# EAGLE design VFDClock (EAGLE 9.2.2)

## Sheet 1 of 3: Power and Logic
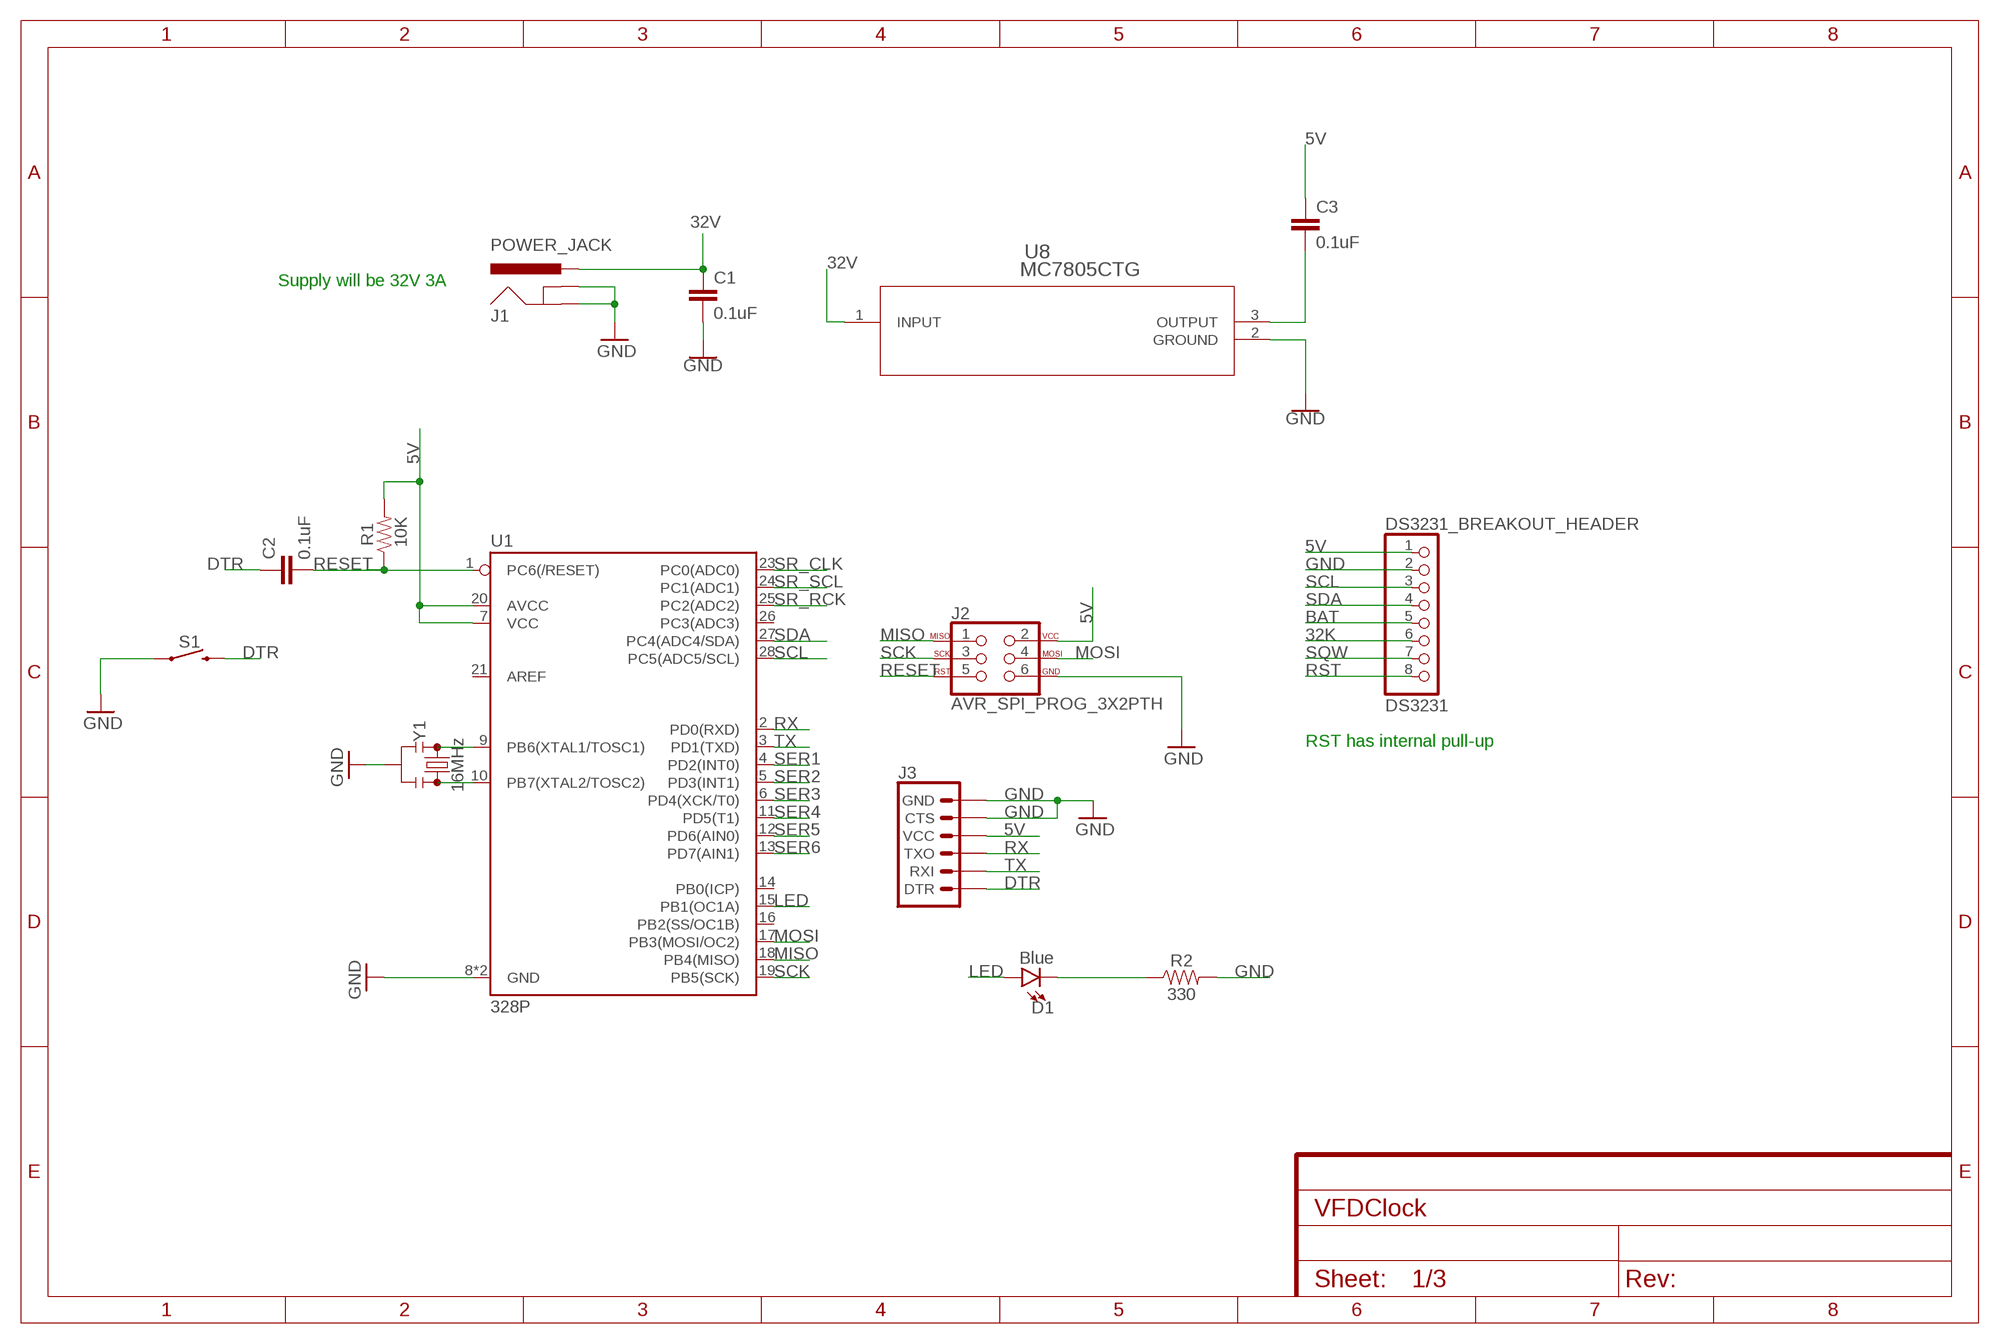
[diagram p0: schematic, sheet 1]

### Parts
C1  0.1uF  0.1UF-KIT-EZ-50V-20%  [CAP-PTH-SMALL-KIT]
C2  0.1uF  0.1UF-KIT-EZ-50V-20%  [CAP-PTH-SMALL-KIT]
C3  0.1uF  .1UF-CER  [0402-CAP]
D1  Blue  LED5MM  [LED_5MM]
DS3231_BREAKOUT_HEADER  DS3231  HEADER-1X870MIL  [1X08_ROUND_70]
J1  POWER_JACK  [POWER_JACK_PTH]
J2  AVR_SPI_PROG_3X2PTH  [2X3]
J3  6_PIN_SERIAL_TARGETLONGPADS  [1X06_LONGPADS]
R1  10K  RESISTORAXIAL-0.3  [AXIAL-0.3]
R2  330  330OHM-HORIZ-1/10W-5%  [AXIAL-0.3]
S1  MOMENTARY-SWITCH-SPST-PTH-6.0MM  [TACTILE_SWITCH_PTH_6.0MM]
U1  328P  ATMEGA328P_PDIP  [DIP28]
U8  MC7805CTG  [TO-220AB]
Y1  16MHz  RESONATORPTH-7.6X3.8  [RESONATOR-PTH-7.6X3.8]

### Nets
5V: C3.1 DS3231_BREAKOUT_HEADER.1 J2.2 J3.4(VCC) R1.P$2 U1.7(VCC) U1.20(AVCC) ; also sheet 3
5V_BEFORECAP: C3.2 U8.3(OUTPUT)
32K: DS3231_BREAKOUT_HEADER.6
32V: C1.1 J1.PWR U8.1(INPUT) ; also sheet 2,3
BAT: DS3231_BREAKOUT_HEADER.5
DTR: C2.1 J3.1(DTR) S1.3
GND: C1.2 DS3231_BREAKOUT_HEADER.2 J1.GND J1.GNDBREAK J2.6 J3.5(CTS) J3.6(GND) R2.P$2 S1.1 U1.8(GND) U1.22(GND) U8.2(GROUND) Y1.2 ; also sheet 2,3
LED: D1.A U1.15(PB1(OC1A))
MISO: J2.1 U1.18(PB4(MISO))
MOSI: J2.4 U1.17(PB3(MOSI/OC2))
N$9: U1.9(PB6(XTAL1/TOSC1)) Y1.1
N$10: U1.10(PB7(XTAL2/TOSC2)) Y1.3
N$51: D1.K(C) R2.P$1
RESET: C2.2 J2.5 R1.P$1 U1.1(PC6(/RESET))
RST: DS3231_BREAKOUT_HEADER.8
RX: J3.3(TXO) U1.2(PD0(RXD))
SCK: J2.3 U1.19(PB5(SCK))
SCL: DS3231_BREAKOUT_HEADER.3 U1.28(PC5(ADC5/SCL))
SDA: DS3231_BREAKOUT_HEADER.4 U1.27(PC4(ADC4/SDA))
SER1: U1.4(PD2(INT0)) ; also sheet 3
SER2: U1.5(PD3(INT1)) ; also sheet 3
SER3: U1.6(PD4(XCK/T0)) ; also sheet 3
SER4: U1.11(PD5(T1)) ; also sheet 3
SER5: U1.12(PD6(AIN0)) ; also sheet 3
SER6: U1.13(PD7(AIN1)) ; also sheet 3
SQW: DS3231_BREAKOUT_HEADER.7
SR_CLK: U1.23(PC0(ADC0)) ; also sheet 3
SR_RCK: U1.25(PC2(ADC2)) ; also sheet 3
SR_SCL: U1.24(PC1(ADC1)) ; also sheet 3
TX: J3.2(RXI) U1.3(PD1(TXD))
Unconnected: U1.14(PB0(ICP)) U1.16(PB2(SS/OC1B)) U1.21(AREF) U1.26(PC3(ADC3))

### Notes on the sheet
- Supply will be 32V 3A
- RST has internal pull-up

## Sheet 2 of 3: VFDs
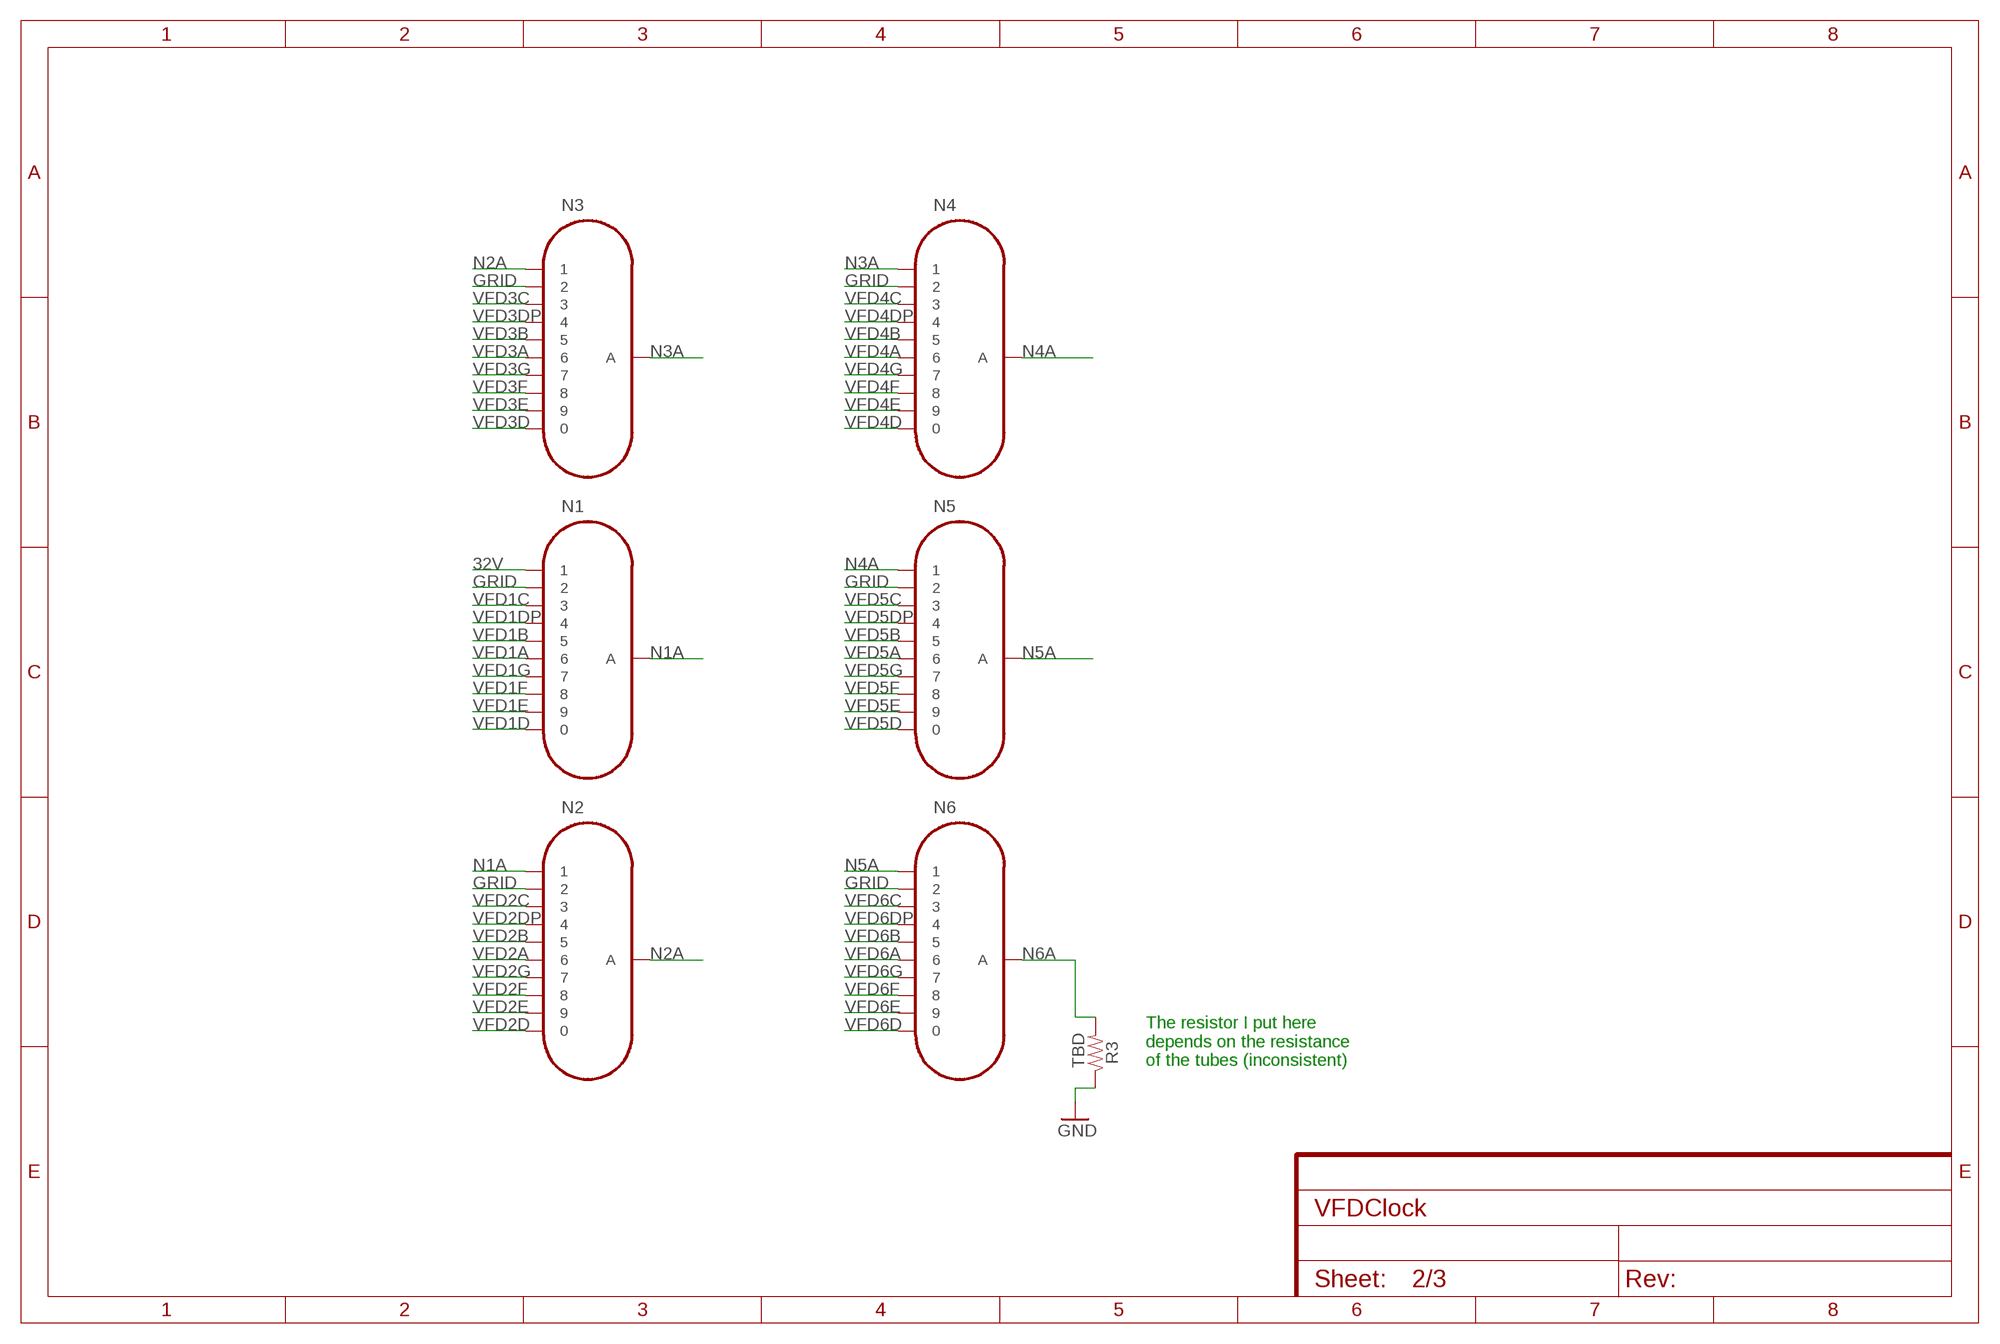
[diagram p1: schematic, sheet 2]

### Parts
N1  IN-8  [IN-8]
N2  IN-8  [IN-8]
N3  IN-8  [IN-8]
N4  IN-8  [IN-8]
N5  IN-8  [IN-8]
N6  IN-8  [IN-8]
R3  TBD  RESISTORAXIAL-0.3  [AXIAL-0.3]

### Nets
32V: N1.1 ; also sheet 1,3
GND: R3.P$1 ; also sheet 1,3
GRID: N1.2 N2.2 N3.2 N4.2 N5.2 N6.2
N1A: N1.A N2.1
N2A: N2.A N3.1
N3A: N3.A N4.1
N4A: N4.A N5.1
N5A: N5.A N6.1
N6A: N6.A R3.P$2
VFD1A: N1.6 ; also sheet 3
VFD1B: N1.5 ; also sheet 3
VFD1C: N1.3 ; also sheet 3
VFD1D: N1.0 ; also sheet 3
VFD1DP: N1.4 ; also sheet 3
VFD1E: N1.9 ; also sheet 3
VFD1F: N1.8 ; also sheet 3
VFD1G: N1.7 ; also sheet 3
VFD2A: N2.6 ; also sheet 3
VFD2B: N2.5 ; also sheet 3
VFD2C: N2.3 ; also sheet 3
VFD2D: N2.0 ; also sheet 3
VFD2DP: N2.4 ; also sheet 3
VFD2E: N2.9 ; also sheet 3
VFD2F: N2.8 ; also sheet 3
VFD2G: N2.7 ; also sheet 3
VFD3A: N3.6 ; also sheet 3
VFD3B: N3.5 ; also sheet 3
VFD3C: N3.3 ; also sheet 3
VFD3D: N3.0 ; also sheet 3
VFD3DP: N3.4 ; also sheet 3
VFD3E: N3.9 ; also sheet 3
VFD3F: N3.8 ; also sheet 3
VFD3G: N3.7 ; also sheet 3
VFD4A: N4.6 ; also sheet 3
VFD4B: N4.5 ; also sheet 3
VFD4C: N4.3 ; also sheet 3
VFD4D: N4.0 ; also sheet 3
VFD4DP: N4.4 ; also sheet 3
VFD4E: N4.9 ; also sheet 3
VFD4F: N4.8 ; also sheet 3
VFD4G: N4.7 ; also sheet 3
VFD5A: N5.6 ; also sheet 3
VFD5B: N5.5 ; also sheet 3
VFD5C: N5.3 ; also sheet 3
VFD5D: N5.0 ; also sheet 3
VFD5DP: N5.4 ; also sheet 3
VFD5E: N5.9 ; also sheet 3
VFD5F: N5.8 ; also sheet 3
VFD5G: N5.7 ; also sheet 3
VFD6A: N6.6 ; also sheet 3
VFD6B: N6.5 ; also sheet 3
VFD6C: N6.3 ; also sheet 3
VFD6D: N6.0 ; also sheet 3
VFD6DP: N6.4 ; also sheet 3
VFD6E: N6.9 ; also sheet 3
VFD6F: N6.8 ; also sheet 3
VFD6G: N6.7 ; also sheet 3

### Notes on the sheet
- The resistor I put here
  depends on the resistance
  of the tubes (inconsistent)

## Sheet 3 of 3: High Side Switches
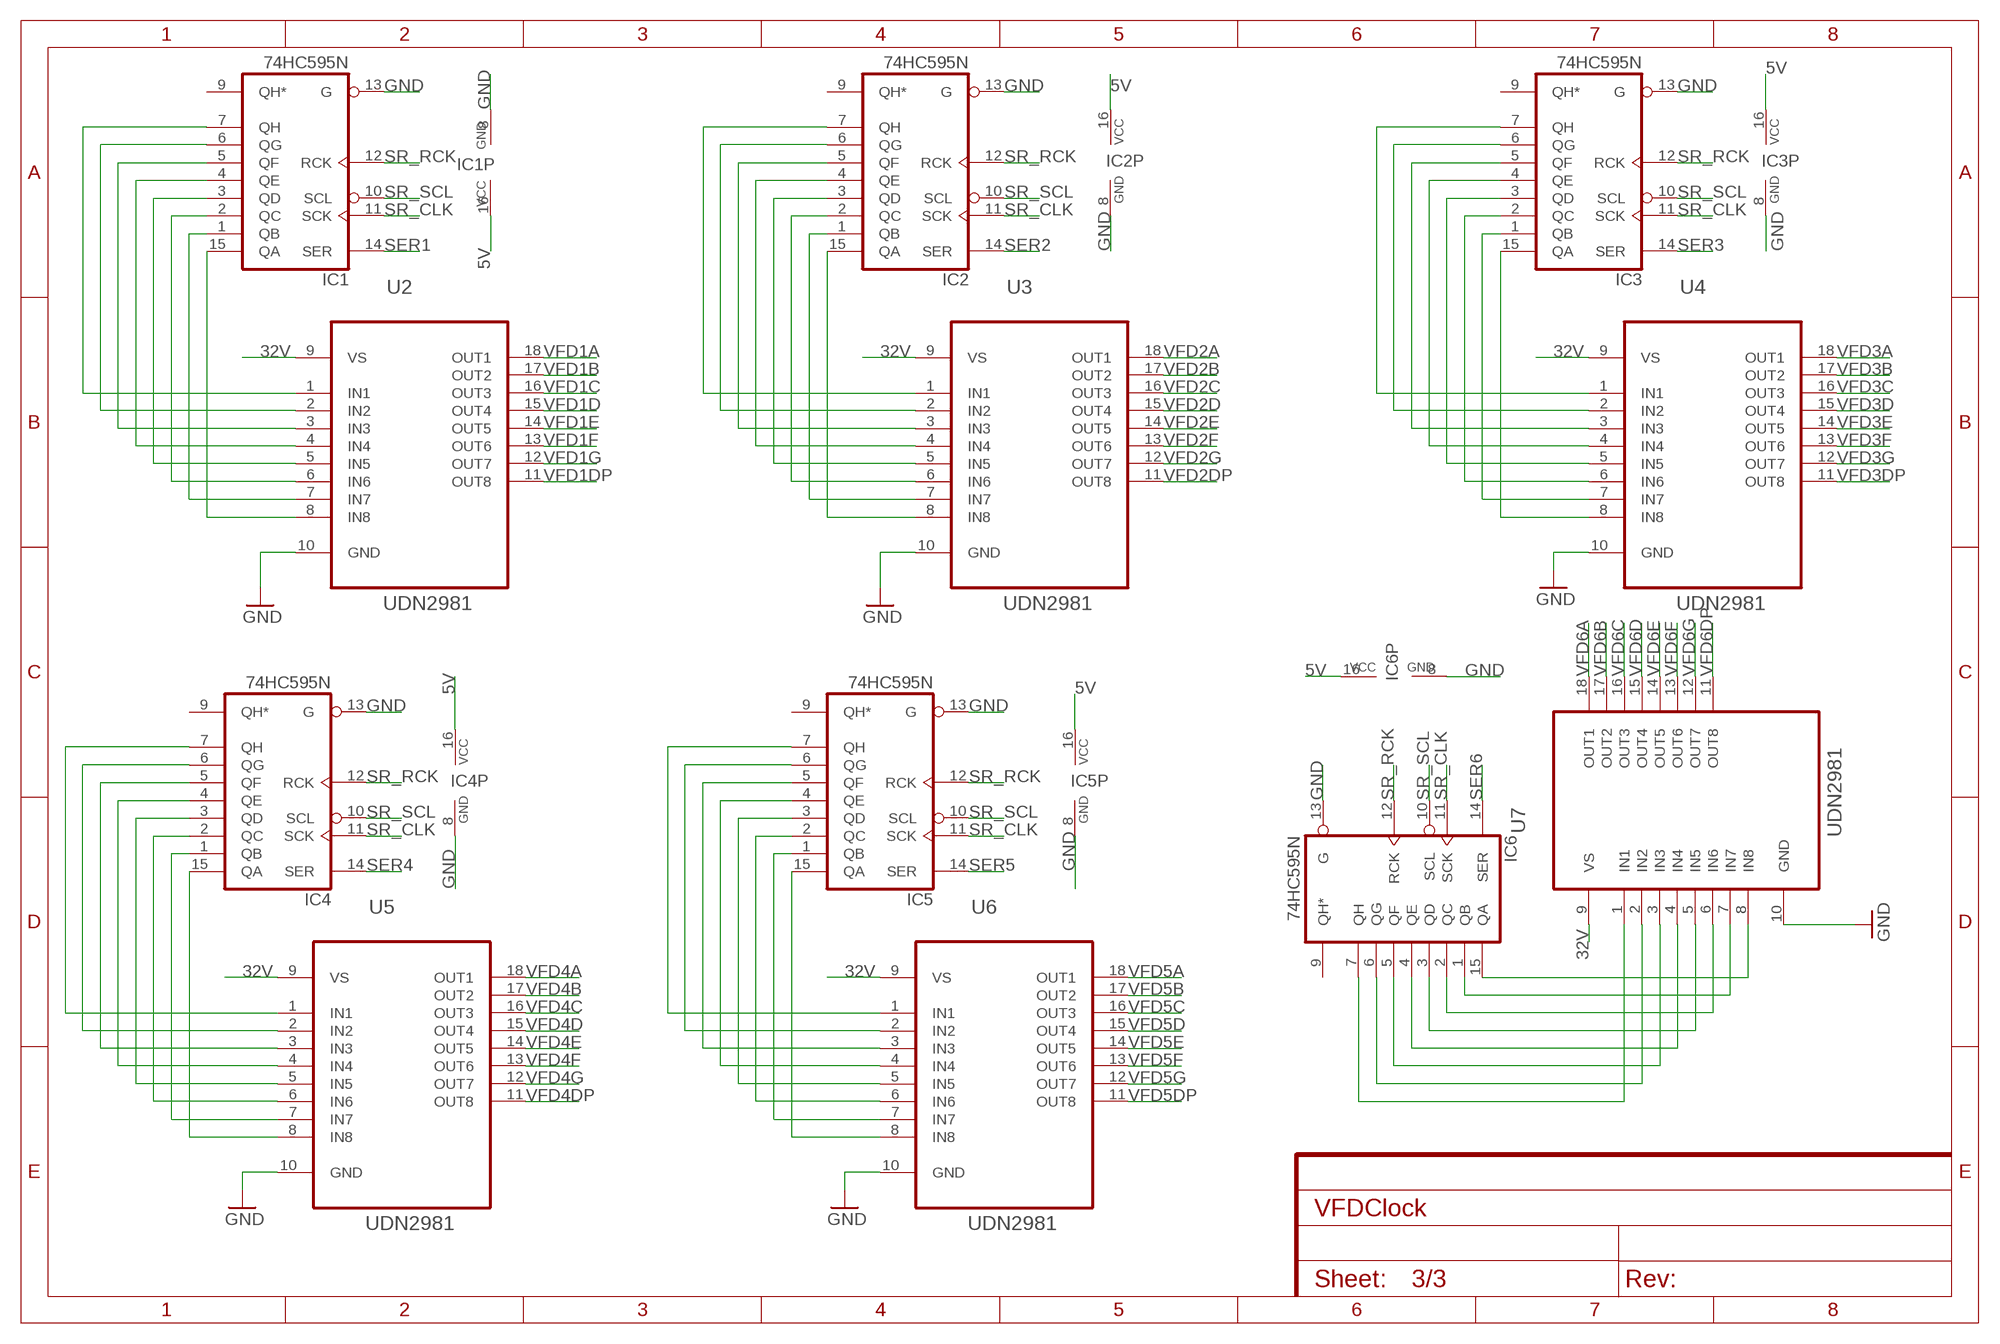
[diagram p2: schematic, sheet 3]

### Parts
IC1  74HC595N  [DIL16]
IC2  74HC595N  [DIL16]
IC3  74HC595N  [DIL16]
IC4  74HC595N  [DIL16]
IC5  74HC595N  [DIL16]
IC6  74HC595N  [DIL16]
U2  UDN2981  [DIP254P762X533-18]
U3  UDN2981  [DIP254P762X533-18]
U4  UDN2981  [DIP254P762X533-18]
U5  UDN2981  [DIP254P762X533-18]
U6  UDN2981  [DIP254P762X533-18]
U7  UDN2981  [DIP254P762X533-18]

### Nets
5V: IC1.16(VCC) IC2.16(VCC) IC3.16(VCC) IC4.16(VCC) IC5.16(VCC) IC6.16(VCC) ; also sheet 1
32V: U2.9(VS) U3.9(VS) U4.9(VS) U5.9(VS) U6.9(VS) U7.9(VS) ; also sheet 1,2
GND: IC1.8(GND) IC1.13(G) IC2.8(GND) IC2.13(G) IC3.8(GND) IC3.13(G) IC4.8(GND) IC4.13(G) IC5.8(GND) IC5.13(G) IC6.8(GND) IC6.13(G) U2.10(GND) U3.10(GND) U4.10(GND) U5.10(GND) U6.10(GND) U7.10(GND) ; also sheet 1,2
N$1: IC1.7(QH) U2.1(IN1)
N$2: IC1.6(QG) U2.2(IN2)
N$3: IC1.3(QD) U2.5(IN5)
N$4: IC1.5(QF) U2.3(IN3)
N$5: IC1.4(QE) U2.4(IN4)
N$6: IC1.2(QC) U2.6(IN6)
N$7: IC1.1(QB) U2.7(IN7)
N$8: IC1.15(QA) U2.8(IN8)
N$11: IC2.7(QH) U3.1(IN1)
N$12: IC2.6(QG) U3.2(IN2)
N$13: IC2.5(QF) U3.3(IN3)
N$14: IC2.4(QE) U3.4(IN4)
N$15: IC2.3(QD) U3.5(IN5)
N$16: IC2.2(QC) U3.6(IN6)
N$17: IC2.1(QB) U3.7(IN7)
N$18: IC2.15(QA) U3.8(IN8)
N$19: IC3.7(QH) U4.1(IN1)
N$20: IC3.6(QG) U4.2(IN2)
N$21: IC3.5(QF) U4.3(IN3)
N$22: IC3.4(QE) U4.4(IN4)
N$23: IC3.3(QD) U4.5(IN5)
N$24: IC3.2(QC) U4.6(IN6)
N$25: IC3.1(QB) U4.7(IN7)
N$26: IC3.15(QA) U4.8(IN8)
N$27: IC4.7(QH) U5.1(IN1)
N$28: IC4.6(QG) U5.2(IN2)
N$29: IC4.5(QF) U5.3(IN3)
N$30: IC4.4(QE) U5.4(IN4)
N$31: IC4.3(QD) U5.5(IN5)
N$32: IC4.2(QC) U5.6(IN6)
N$33: IC4.1(QB) U5.7(IN7)
N$34: IC4.15(QA) U5.8(IN8)
N$35: IC5.7(QH) U6.1(IN1)
N$36: IC5.6(QG) U6.2(IN2)
N$37: IC5.5(QF) U6.3(IN3)
N$38: IC5.4(QE) U6.4(IN4)
N$39: IC5.3(QD) U6.5(IN5)
N$40: IC5.2(QC) U6.6(IN6)
N$41: IC5.1(QB) U6.7(IN7)
N$42: IC5.15(QA) U6.8(IN8)
N$43: IC6.7(QH) U7.1(IN1)
N$44: IC6.6(QG) U7.2(IN2)
N$45: IC6.5(QF) U7.3(IN3)
N$46: IC6.4(QE) U7.4(IN4)
N$47: IC6.3(QD) U7.5(IN5)
N$48: IC6.2(QC) U7.6(IN6)
N$49: IC6.1(QB) U7.7(IN7)
N$50: IC6.15(QA) U7.8(IN8)
SER1: IC1.14(SER) ; also sheet 1
SER2: IC2.14(SER) ; also sheet 1
SER3: IC3.14(SER) ; also sheet 1
SER4: IC4.14(SER) ; also sheet 1
SER5: IC5.14(SER) ; also sheet 1
SER6: IC6.14(SER) ; also sheet 1
SR_CLK: IC1.11(SCK) IC2.11(SCK) IC3.11(SCK) IC4.11(SCK) IC5.11(SCK) IC6.11(SCK) ; also sheet 1
SR_RCK: IC1.12(RCK) IC2.12(RCK) IC3.12(RCK) IC4.12(RCK) IC5.12(RCK) IC6.12(RCK) ; also sheet 1
SR_SCL: IC1.10(SCL) IC2.10(SCL) IC3.10(SCL) IC4.10(SCL) IC5.10(SCL) IC6.10(SCL) ; also sheet 1
VFD1A: U2.18(OUT1) ; also sheet 2
VFD1B: U2.17(OUT2) ; also sheet 2
VFD1C: U2.16(OUT3) ; also sheet 2
VFD1D: U2.15(OUT4) ; also sheet 2
VFD1DP: U2.11(OUT8) ; also sheet 2
VFD1E: U2.14(OUT5) ; also sheet 2
VFD1F: U2.13(OUT6) ; also sheet 2
VFD1G: U2.12(OUT7) ; also sheet 2
VFD2A: U3.18(OUT1) ; also sheet 2
VFD2B: U3.17(OUT2) ; also sheet 2
VFD2C: U3.16(OUT3) ; also sheet 2
VFD2D: U3.15(OUT4) ; also sheet 2
VFD2DP: U3.11(OUT8) ; also sheet 2
VFD2E: U3.14(OUT5) ; also sheet 2
VFD2F: U3.13(OUT6) ; also sheet 2
VFD2G: U3.12(OUT7) ; also sheet 2
VFD3A: U4.18(OUT1) ; also sheet 2
VFD3B: U4.17(OUT2) ; also sheet 2
VFD3C: U4.16(OUT3) ; also sheet 2
VFD3D: U4.15(OUT4) ; also sheet 2
VFD3DP: U4.11(OUT8) ; also sheet 2
VFD3E: U4.14(OUT5) ; also sheet 2
VFD3F: U4.13(OUT6) ; also sheet 2
VFD3G: U4.12(OUT7) ; also sheet 2
VFD4A: U5.18(OUT1) ; also sheet 2
VFD4B: U5.17(OUT2) ; also sheet 2
VFD4C: U5.16(OUT3) ; also sheet 2
VFD4D: U5.15(OUT4) ; also sheet 2
VFD4DP: U5.11(OUT8) ; also sheet 2
VFD4E: U5.14(OUT5) ; also sheet 2
VFD4F: U5.13(OUT6) ; also sheet 2
VFD4G: U5.12(OUT7) ; also sheet 2
VFD5A: U6.18(OUT1) ; also sheet 2
VFD5B: U6.17(OUT2) ; also sheet 2
VFD5C: U6.16(OUT3) ; also sheet 2
VFD5D: U6.15(OUT4) ; also sheet 2
VFD5DP: U6.11(OUT8) ; also sheet 2
VFD5E: U6.14(OUT5) ; also sheet 2
VFD5F: U6.13(OUT6) ; also sheet 2
VFD5G: U6.12(OUT7) ; also sheet 2
VFD6A: U7.18(OUT1) ; also sheet 2
VFD6B: U7.17(OUT2) ; also sheet 2
VFD6C: U7.16(OUT3) ; also sheet 2
VFD6D: U7.15(OUT4) ; also sheet 2
VFD6DP: U7.11(OUT8) ; also sheet 2
VFD6E: U7.14(OUT5) ; also sheet 2
VFD6F: U7.13(OUT6) ; also sheet 2
VFD6G: U7.12(OUT7) ; also sheet 2
Unconnected: IC1.9(QH*) IC2.9(QH*) IC3.9(QH*) IC4.9(QH*) IC5.9(QH*) IC6.9(QH*)

## Library data of the parts
C1 C2 = SparkFun-Capacitors:0.1UF: 0.1µF ceramic capacitors A capacitor is a passive two-terminal electrical component used to store electrical energy temporarily in an electric field.; PROD_ID: CAP-08370
C3 = SparkFun-Retired:.1UF-CER: .1uF ceramic SMT CAP-00810- 25V +80%/-20% (0603) CAP-08390- 100V 10% (0603) CAP-08604- 25V 5% (0603); PROD_ID: CAP-00810
D1 = SparkFun-LED:LED: LED (Generic) Standard schematic elements and footprints for 5mm, 3mm, 1206, and 0603 sized LEDs. Generic LEDs with no color specified.
DS3231_BREAKOUT_HEADER = microbuilder:HEADER-1X8: PIN HEADER
IC1-IC6 = 74xx-eu:74*595: 8-bit SHIFT REGISTER, output latch
J1 = SparkFun-Connectors:POWER_JACK: Power Jack Connector This is the standard 5.5mm barrel jack for power. The PTH is the most common, proven, reliable, footprint. The Slot footprint only works if the mill layer is transmitted to the PCB fab house so be warned. Here are the connectors we sell at SparkFun: DC Barrel Power Jack/Connector <https://www.sparkfun.com/products/119> (PRT-00119) DC Barrel Power Jack/Connector (SMD) <https://www.sparkfun.com/products/12748> (PRT-12748) DC Barrel Jack Adapter - Breadboard Compatible <https://www.sparkfun.com/products/10811> (PRT-10811) It is used on this SparkFun product (and many, many others): SparkFun RedBoard - Programmed with Arduino <https://www.sparkfun.com/products/12757> (DEV-12757) Also, if you need a mating power supply or connector, please check these out: Wall Adapter Power Supply - 9VDC 650mA <https://www.sparkfun.com/products/298> (TOL-00298) DC Barrel Jack Adapter - Male <https://www.sparkfun.com/products/10287> (PRT-10287); PROD_ID: CONN-08197
J2 = SparkFun-Connectors:AVR_SPI_PROG_3X2: AVR ISP 6 Pin This is the reduced ISP connector for AVR programming. Common on Arduino. This footprint will take up less PCB space and can be used with a 10-pin to 6-pin adapter such as SKU: BOB-08508 **Special note about "TEST_POINT" package. The stop mask is on the top side, so if you want your programming test points to be on the bottom of your board, make sure to place this package on the bottom side of the board. This also ensure that the orientation to program from the bottom side will be correct. SparkFun Products: SparkFun ISP Pogo Adapter <https://www.sparkfun.com/products/11591> - NS Tiny AVR Programmer <https://www.sparkfun.com/products/11801> -PTH
J3 = SparkFun-Connectors:6_PIN_SERIAL_TARGET: 6-pin header connection for use with the "FTDI BASIC" pinout - TARGET SIDE. Also known as "Arduino Serial Program Header". It is used to mate with our FTDI Basic serial programmers using the Arduino IDE. Note, this device has "TARGET" in the name. It is intended to be used on a design that contains a target micro-controller that you wish to program. The "sister" device, named "CABLE" is inteneded to be used on a design that usually lives on the end of your USB cable and prvides the converter chip (FTDI232 or FTDI231x) to commnicate serial RX/TX. You can populate with some of these: Break Away Headers - Straight <https://www.sparkfun.com/products/116> (PRT-00116) For reference (or to suit your programming needs) check out these designs: SparkFun FTDI Basic Breakout - 5V <https://www.sparkfun.com/products/9716> (DEV-09716) SparkFun FTDI Basic Breakout - 3.3V <https://www.sparkfun.com/products/9873> (DEV-09873) SparkFun FTDI SmartBasic <https://www.sparkfun.com/products/12935> (DEV-12935) SparkFun Beefy 3 - FTDI Basic Breakout <https://www.sparkfun.com/products/13746> (DEV-13746)
N1-N6 = russian-nixies:IN-8: IN-8: medium numeric frontview nixie tube
R1 R3 = SparkFun-Resistors:RESISTOR: Generic Resistor Package
R2 = SparkFun-Resistors:330OHM: 330Ω resistor A resistor is a passive two-terminal electrical component that implements electrical resistance as a circuit element. Resistors act to reduce current flow, and, at the same time, act to lower voltage levels within circuits. - Wikipedia; PROD_ID: RES-8371
S1 = SparkFun-Switches:MOMENTARY-SWITCH-SPST: Momentary Switch (Pushbutton) - SPST Normally-open (NO) SPST momentary switches (buttons, pushbuttons). Variants PTH-12MM - 12mm square, through-hole Momentary Pushbutton Switch - 12mm Square <https://www.sparkfun.com/products/9190> (COM-09190) PTH-6.0MM, PTH-6.0MM-KIT - 6.0mm square, through-hole Mini Pushbutton Switch <https://www.sparkfun.com/products/97> (COM-00097) KIT package intended for soldering kit's - only one side of pads' copper is exposed. PTH-RIGHT-ANGLE-KIT - Right-angle, through-hole Right Angle Tactile Button <https://www.sparkfun.com/products/10791> - Used on SparkFun BigTime Watch Kit <https://www.sparkfun.com/products/11734> SMD-12MM - 12mm square, surface-mount Tactile Button - SMD (12mm) <https://www.sparkfun.com/products/12993> (COM-12993) Used on SparkFun PicoBoard <https://www.sparkfun.com/products/11888> SMD-4.5MM - 4.5mm Square Trackball Switch Used on SparkFun Blackberry Trackballer Breakout <https://www.sparkfun.com/products/13169> SMD-4.6MMX2.8MM - 4.60mm x 2.80mm, surface mount Used on SparkFun SAMD21 Mini Breakout <https://www.sparkfun.com/products/13664> SMD-5.2MM, SMD-5.2-REDUNDANT - 5.2mm square, surface-mount Mini Pushbutton Switch - SMD <https://www.sparkfun.com/products/8720> (COM-08720) Used on Arduino Pro Mini <https://www.sparkfun.com/products/11114> REDUNDANT package connects both switch circuits together SMD-6.0X3.5MM - 6.0 x 3.5mm, surface mount Momentary Reset Switch SMD <https://www.sparkfun.com/products/8229> (COM-08229) SMD-6.2MM-TALL - 6.2mm square, surface mount Tactile Button - SMD (6mm) <https://www.sparkfun.com/products/12992> Used on SparkFun Digital Sandbox <https://www.sparkfun.com/products/12651> SMD-RIGHT-ANGLE - Right-angle, surface mount Used on SparkFun Block for Intel® Edison - Arduino <https://www.sparkfun.com/products/13036>; PROD_ID: SWCH-08441; SF_SKU: COM-00097
U1 = SparkFun-IC-Microcontroller:ATMEGA328P_PDIP: Atmel 328P Through hole ATMEGA328P uC used in the Arduino 32kb flash, 1k EEPROM, 2k SRAM Datasheet <http://www.sparkfun.com/datasheets/Components/SMD/ATMega328.pdf> SparkFun Products Storefront component: AVR 28 Pin 20MHz 32K 6A/D - ATMega328P <https://www.sparkfun.com/products/9061> (COM-09061) SparkFun Simon Says - Through-Hole Soldering Kit <https://www.sparkfun.com/products/10547> (KIT-10547) SparkFun Learn to Solder - Simon Says <https://www.sparkfun.com/products/13708> (KIT-13708) SparkFun BigTime Watch Kit <https://www.sparkfun.com/products/11734> (KIT-11734) SparkFun ClockIt <https://www.sparkfun.com/products/10930> (KIT-10930) SparkFun Serial Enabled LCD Kit <https://www.sparkfun.com/products/10097> (LCD-10097) SparkFun Simon Tilts - Through Hole Soldering Kit <https://www.sparkfun.com/products/12634> (KIT-12634) SparkFun Frequency Counter Kit <https://www.sparkfun.com/products/10140> (KIT-10140) FabFM Radio Kit <https://www.sparkfun.com/products/11043> (KIT-11043) SparkFun Binary Blaster Kit <https://www.sparkfun.com/products/12037> (KIT-12037) SparkFun Metro-Gnome <https://www.sparkfun.com/products/9236> (KIT-09236) ATmega328 with Arduino Optiboot (Uno) <https://www.sparkfun.com/products/10524> (DEV-10524); PROD_ID: IC-09136
U2-U7 = UDN2981:UDN2981: 8-Channel Source Drivers; AVAILABILITY: Unavailable; MF: Allegro MicroSystems LLC; MP: UDN2981; PACKAGE: DIP-18 Allegro MicroSystems LLC; PRICE: None
U8 = MC7805CTG:MC7805CTG; MANUFACTURER_PART_NUMBER: MC7805CTG; VENDOR: ON Semiconductor
Y1 = SparkFun-Clocks:RESONATOR: Resonators (Generic) Ceramic resonators are clock-generating components, often used to control timing in microcontrollers. They usually have 3 pins: two pins for oscillation, and one pin for ground. Compared to crystals, resonators have worse tolerance, but are usually much cheaper. Plus, they have built-in load capacitors! These devices are used on boards like the Arduino Pro 8MHz <https://www.sparkfun.com/products/11114> and Arduino Pro 16MHz <https://www.sparkfun.com/products/11113>.

## Board
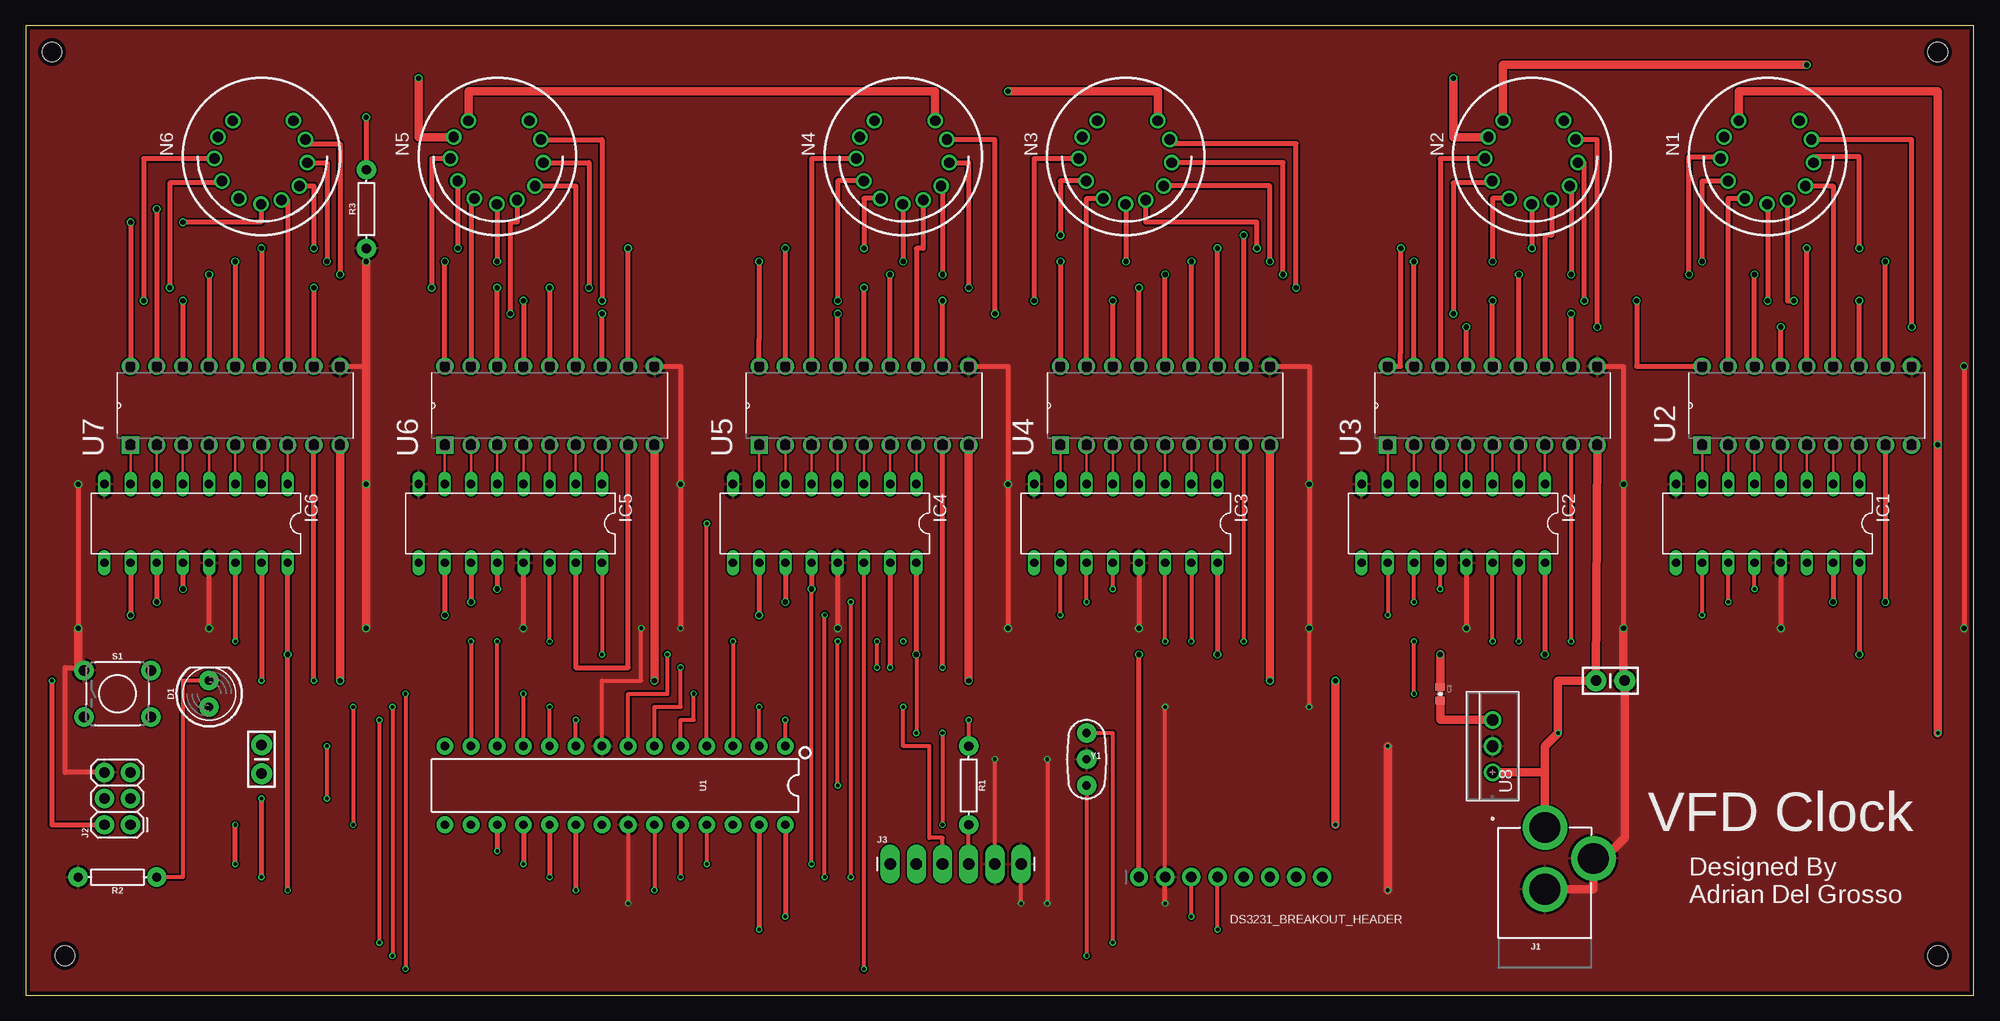
[diagram p3: board, top side]
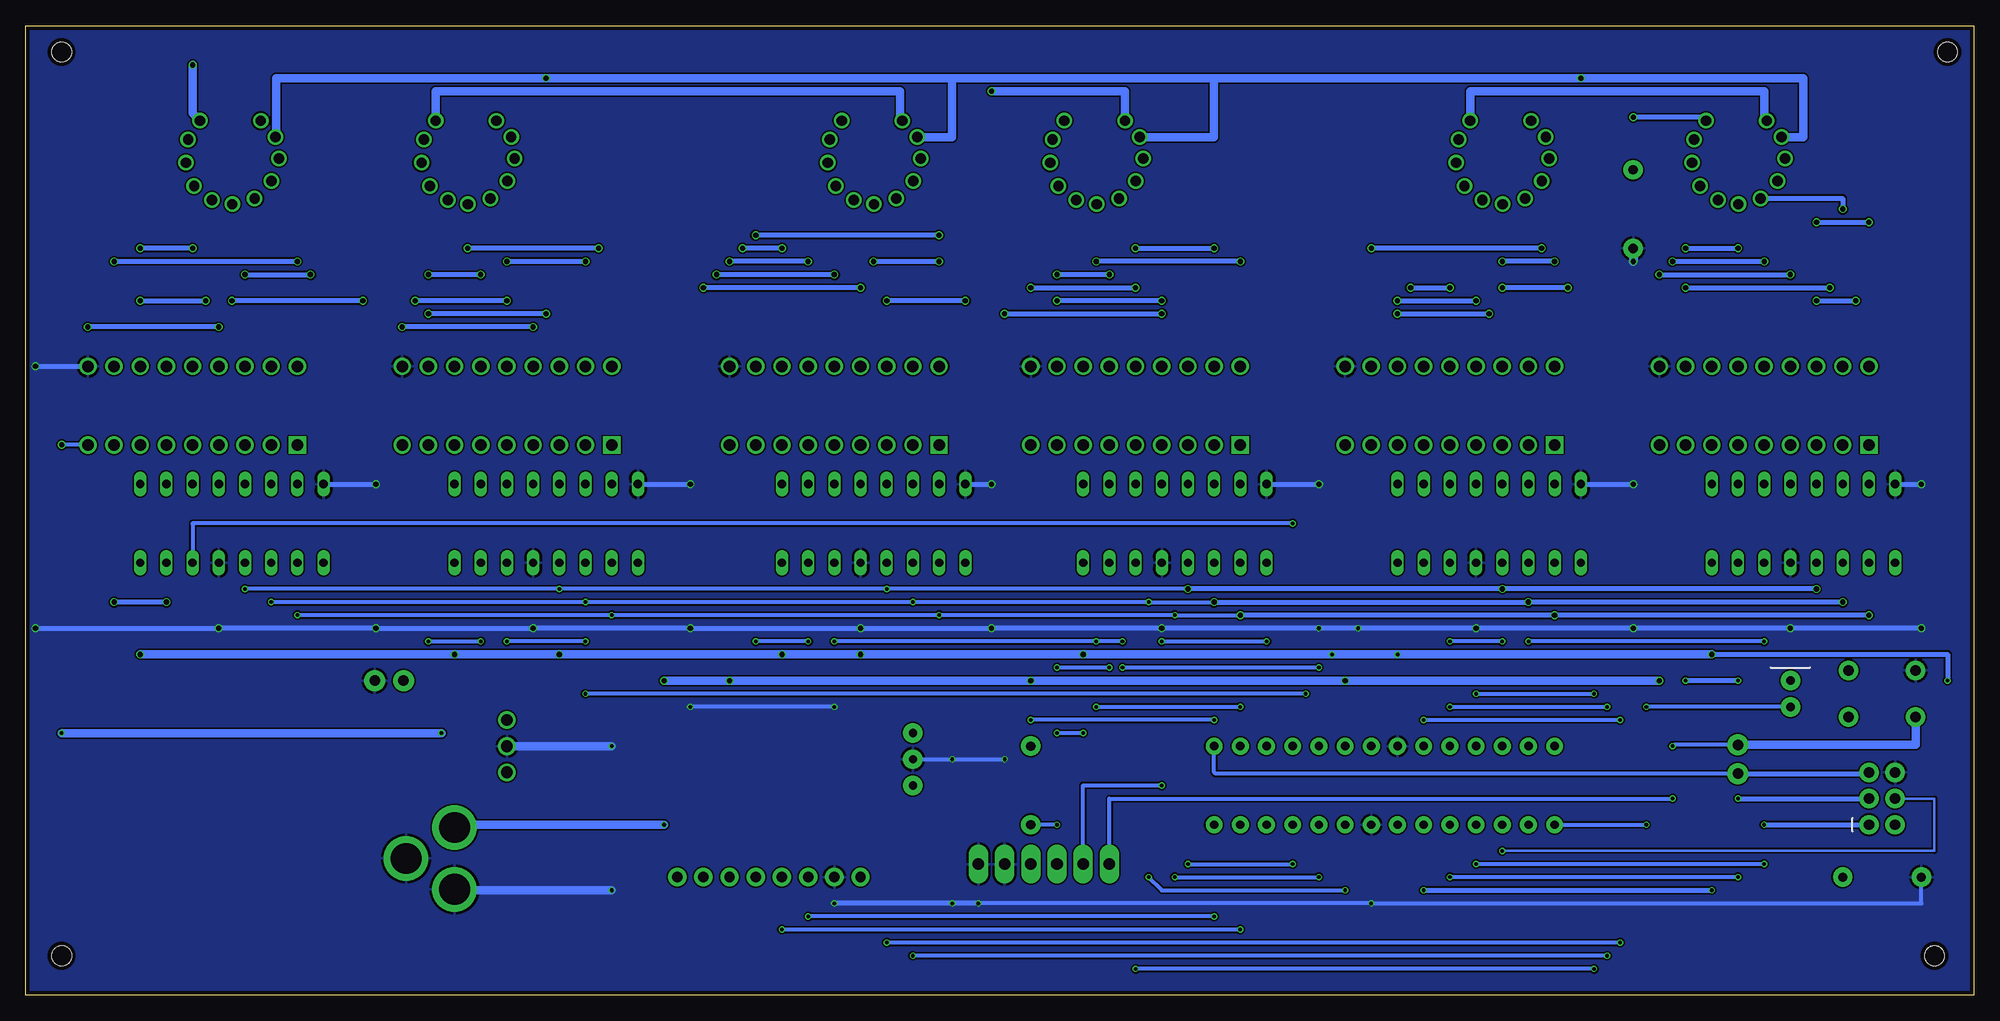
[diagram p4: board, bottom side, seen from below]

Size 188.9 x 93.97 mm. Coordinates in mm from the lower left corner, seen from the top.
Outline: 0,0 188.9,0 188.9,93.97 0,93.97 0,0
Copper layers (1*16): Top 0.035559375mm / dielectric 1.6mm / Bottom 0.035559375mm
Design rules "oshpark-2layer": minimum track width 6mil, minimum drill 10mil, track to track 6mil, track to pad 6mil, pad to pad 6mil, via to via 6mil, smd to smd 6mil, copper to edge 15mil, drill to drill 6mil, minimum pad ring 5mil, minimum via ring 5mil, stop-mask expansion 2.5mil, vias tented up to drill 0mil, thermal gap 10mil
Holes 1.91 mm at 3.81,3.81 185.42,3.81 185.42,91.44 2.54,91.44

### Footprints (pad centres in the part's own frame; a part is rotated, then mirrored left to right if it is on the bottom)
CAP-PTH-SMALL-KIT = drill 1.016 pad 2.032: 1 -1.397,0; 2 1.397,0
0402-CAP = smd 0.7 x 0.9: 1 -0.65,0; 2 0.65,0
LED_5MM = drill 0.813 pad 1.88: A -1.27,0; K 1.27,0
1X08_ROUND_70 = drill 1 pad 1.778: 1 -8.89,0; 2 -6.35,0; 3 -3.81,0; 4 -1.27,0; 5 1.27,0; 6 3.81,0; 7 6.35,0; 8 8.89,0
DIL16 = drill 0.813 long: 1 -8.89,-3.81; 2 -6.35,-3.81; 3 -3.81,-3.81; 4 -1.27,-3.81; 5 1.27,-3.81; 6 3.81,-3.81; 7 6.35,-3.81; 8 8.89,-3.81; 9 8.89,3.81; 10 6.35,3.81; 11 3.81,3.81; 12 1.27,3.81; 13 -1.27,3.81; 14 -3.81,3.81; 15 -6.35,3.81; 16 -8.89,3.81
POWER_JACK_PTH = drill 2.997 pad 4.318: GND 0,7.7; GNDBREAK 4.7,10.7; PWR 0,13.7
2X3 = drill 1.016 pad 1.88: 1 0,0; 2 0,2.54; 3 2.54,0; 4 2.54,2.54; 5 5.08,0; 6 5.08,2.54
1X06_LONGPADS = drill 1.118 pad 1.88 long: 1 0,0; 2 2.54,0; 3 5.08,0; 4 7.62,0; 5 10.16,0; 6 12.7,0
IN-8 = drill 1: 0 -4.244,-1.655; 1 2.792,-3.483; 2 4.222,-1.907; 3 4.556,0.189; 4 3.837,2.348; 5 2.203,4.052; 6 0.034,4.603; 7 -1.928,4.186; 8 -3.666,2.83; 9 -4.461,0.584; A -3.101,-3.49
AXIAL-0.3 = drill 0.9 pad 1.88: P$1 -3.81,0; P$2 3.81,0
TACTILE_SWITCH_PTH_6.0MM = drill 1.016 pad 1.88: 1 -3.251,2.261; 2 3.251,2.261; 3 -3.251,-2.261; 4 3.251,-2.261
DIP28 = drill 0.813 pad 1.626: 1 -16.51,-3.81; 2 -13.97,-3.81; 3 -11.43,-3.81; 4 -8.89,-3.81; 5 -6.35,-3.81; 6 -3.81,-3.81; 7 -1.27,-3.81; 8 1.27,-3.81; 9 3.81,-3.81; 10 6.35,-3.81; 11 8.89,-3.81; 12 11.43,-3.81; 13 13.97,-3.81; 14 16.51,-3.81; 15 16.51,3.81; 16 13.97,3.81; 17 11.43,3.81; 18 8.89,3.81; 19 6.35,3.81; 20 3.81,3.81; 21 1.27,3.81; 22 -1.27,3.81; 23 -3.81,3.81; 24 -6.35,3.81; 25 -8.89,3.81; 26 -11.43,3.81; 27 -13.97,3.81; 28 -16.51,3.81
DIP254P762X533-18 = drill 1.118 square: 1 -7.62,20.32 | drill 1.118: 2 -7.62,17.78; 3 -7.62,15.24; 4 -7.62,12.7; 5 -7.62,10.16; 6 -7.62,7.62; 7 -7.62,5.08; 8 -7.62,2.54; 9 -7.62,0; 10 0,0; 11 0,2.54; 12 0,5.08; 13 0,7.62; 14 0,10.16; 15 0,12.7; 16 0,15.24; 17 0,17.78; 18 0,20.32
TO-220AB = drill 1.143 pad 1.651: 1 -5.08,0; 2 -2.54,0; 3 0,0
RESONATOR-PTH-7.6X3.8 = drill 0.8 pad 1.88: 1 -2.54,0; 2 0,0; 3 2.54,0

### Placement (x,y rotation side)
C1  153.67,30.48 0 top
C2  22.86,22.86 270 top
C3  137.16,29.21 270 top
D1  17.78,29.21 90 top
DS3231_BREAKOUT_HEADER  116.84,11.43 0 top
IC1  168.91,45.72 180 top
IC2  138.43,45.72 180 top
IC3  106.68,45.72 180 top
IC4  77.47,45.72 180 top
IC5  46.99,45.72 180 top
IC6  16.51,45.72 180 top
J1  147.32,2.54 0 top
J2  10.16,16.51 90 top
J3  83.82,12.7 0 top
N1  168.91,81.28 180 top
N2  146.05,81.28 180 top
N3  106.68,81.28 180 top
N4  85.09,81.28 180 top
N5  45.72,81.28 180 top
N6  22.86,81.28 180 top
R1  91.44,20.32 270 top
R2  8.89,11.43 180 top
R3  33.02,76.2 90 top
S1  8.89,29.21 0 top
U1  57.15,20.32 180 top
U2  182.88,60.96 90 top
U3  152.4,60.96 90 top
U4  120.65,60.96 90 top
U5  91.44,60.96 90 top
U6  60.96,60.96 90 top
U7  30.48,60.96 90 top
U8  142.24,26.67 90 top
Y1  102.87,22.86 270 top

### Tracks (layer width: path | path; a pad name or v marks a point on that pad's centre or on a via)
5V  (via drill 0.35, 0.5)
  Top 0.406: v86.36,33.02 v86.36,25.4 | v88.9,25.4 v88.9,16.51 | J3.4 R1.P$2 | U1.7 58.42,29.21 62.23,29.21 v62.23,33.02 | IC5.16 v55.88,33.02
  Top 0.508: IC1.16 v177.8,33.02 | DS3231_BREAKOUT_HEADER.1 v107.95,33.02 | v86.36,33.02 IC4.16 | IC6.16 v25.4,33.02 v25.4,10.16 | IC3.16 v115.57,33.02 | IC2.16 v147.32,33.02 | v2.54,30.48 2.54,16.51 J2.2 | U1.20 v53.34,10.16
  Top 0.813: C3.1 v137.16,33.02
  Bottom 0.406: v86.36,25.4 v88.9,25.4 | v88.9,16.51 R1.P$2
  Bottom 0.508: v25.4,33.02 2.54,33.02 v2.54,30.48 | v53.34,10.16 v25.4,10.16
  Bottom 0.813: v177.8,33.02 v147.32,33.02 v137.16,33.02 v115.57,33.02 v107.95,33.02 v86.36,33.02 v62.23,33.02 v55.88,33.02 v25.4,33.02
5V_BEFORECAP
  Top 0.813: C3.2 137.16,26.67 U8.3
32V  (via drill 0.35, 0.5)
  Top 0.813: 147.32,21.59 147.32,24.13 v148.59,25.4 148.59,30.48 C1.1 U3.9 | 147.32,21.59 J1.PWR | v127,16.51 v127,30.48 | v120.65,30.48 U4.9 | v91.44,30.48 U5.9 | v60.96,30.48 U6.9 | v30.48,30.48 U7.9 | v185.42,25.4 v185.42,53.34 185.42,87.63 166.12,87.63 N1.1 | U8.1 147.32,21.59
  Bottom 0.406: U2.9 v185.42,53.34
  Bottom 0.813: v127,30.48 v120.65,30.48 v91.44,30.48 v60.96,30.48 v30.48,30.48 | v127,16.51 147.05,16.51 J1.PWR | v148.59,25.4 v185.42,25.4
DTR  (via drill 0.35)
  Top 0.406: v29.21,19.05 v29.21,24.13
  Bottom 0.406: J3.1 83.82,19.05 v29.21,19.05 | C2.1 29.08,24.26 v29.21,24.13
  Bottom 0.813: C2.1 5.64,24.26 S1.3
GND  (via drill 0.35, 0.5)
  Top 0.406: U1.22 v58.42,8.89 | J3.5 v93.98,22.86 | U1.8 55.88,30.48 59.69,30.48 v59.69,35.56 | v96.52,8.89 J3.6 | v99.06,22.86 v99.06,8.89 | DS3231_BREAKOUT_HEADER.2 v110.49,27.94 | v124.46,27.94 v124.46,35.56
  Top 0.508: IC2.13 v139.7,35.56 | IC1.13 v170.18,35.56 | IC3.13 v107.95,35.56 | IC4.13 v78.74,35.56 | U5.10 95.25,60.96 v95.25,49.53 v95.25,35.56 | v5.08,49.53 v5.08,35.56 | U4.10 124.46,60.96 v124.46,49.53 v124.46,35.56 | U3.10 154.94,60.96 v154.94,49.53 v154.94,35.56 | U6.10 63.5,60.96 v63.5,49.53 v63.5,35.56 | U7.10 33.02,60.96 | v187.96,60.96 v187.96,35.56 | v17.78,35.56 IC6.13 | v48.26,35.56 IC5.13 | J2.6 3.81,21.59 3.81,31.75 5.36,31.75 S1.1 | v110.49,8.89 DS3231_BREAKOUT_HEADER.2
  Top 0.813: v33.02,35.56 v33.02,49.53 33.02,60.96 v33.02,71.12 | v154.94,35.56 154.94,30.48 C1.2 155.07,15.24 153.07,13.24 J1.GNDBREAK 152.02,10.24 J1.GND | v5.08,35.56 5.08,31.75 S1.1 | v132.08,10.16 v132.08,24.13
  Bottom 0.406: v96.52,8.89 v58.42,8.89 5.08,8.89 R2.P$2 | Y1.2 v99.06,22.86 v93.98,22.86 | v110.49,27.94 v124.46,27.94
  Bottom 0.508: v5.08,35.56 v17.78,35.56 v33.02,35.56 v48.26,35.56 v59.69,35.56 v63.5,35.56 v78.74,35.56 v95.25,35.56 v107.95,35.56 v124.46,35.56 v139.7,35.56 v154.94,35.56 v170.18,35.56 v187.96,35.56 | IC3.8 v95.25,49.53 | IC2.8 v124.46,49.53 | IC4.8 v63.5,49.53 | IC5.8 v33.02,49.53 | IC1.8 v154.94,49.53 | IC6.8 v5.08,49.53 | v187.96,60.96 U2.10 | v96.52,8.89 v99.06,8.89 v110.49,8.89
  Bottom 0.813: U8.2 v132.08,24.13 | J1.GND 147.24,10.16 v132.08,10.16
  Bottom 0.864: R3.P$1 v33.02,71.12
  pour Top: 0,101.6 203.2,101.6 203.2,0 0,0
  pour Bottom: 0,0 0,101.6 203.2,101.6 203.2,0
GRID  (via drill 0.5)
  Top 0.813: N5.2 38.1,83.19 v38.1,88.9 | N2.2 138.43,83.19 v138.43,88.9
  Bottom 0.813: 99.06,88.9 v138.43,88.9 164.59,88.9 164.59,83.24 164.69,83.24 N1.2 | 99.06,88.9 73.66,88.9 | 73.66,88.9 v38.1,88.9 16.51,88.9 16.51,83.19 N6.2 | N4.2 73.66,83.19 73.66,88.9 | N3.2 99.06,83.19 99.06,88.9
LED  (via drill 0.35)
  Top 0.406: v31.75,27.94 v31.75,16.51
  Bottom 0.406: U1.15 v31.75,16.51 | D1.A v31.75,27.94
MISO  (via drill 0.35)
  Top 0.508: U1.18 v48.26,12.7 | v20.32,12.7 v20.32,16.51
  Bottom 0.406: v20.32,12.7 v48.26,12.7
  Bottom 0.508: v20.32,16.51 J2.1
MOSI  (via drill 0.35)
  Top 0.508: U1.17 v45.72,13.97
  Bottom 0.254: J2.4 3.81,19.05 3.81,13.97 v45.72,13.97
N1A  (via drill 0.5)
  Top 0.813: N2.1 143.26,90.17 v172.72,90.17
  Bottom 0.813: v172.72,90.17 172.72,85.48 N1.A
N2A
  Bottom 0.813: N3.1 104.14,84.76 104.14,87.63 149.15,87.63 N2.A
N3A  (via drill 0.5)
  Top 0.813: N3.A 109.78,87.63 v95.25,87.63
  Bottom 0.813: N4.1 82.3,87.63 v95.25,87.63
N4A
  Top 0.813: N5.1 42.93,87.63 88.19,87.63 N4.A
N5A
  Bottom 0.813: N6.1 20.32,84.76 20.32,87.63 41.91,87.63 48.82,87.63 N5.A
N6A  (via drill 0.5)
  Top 0.508: v33.02,85.09 R3.P$2
  Bottom 0.508: N6.A 25.96,85.09 v33.02,85.09
N$1
  Top 0.254: IC1.7 U2.1
N$2
  Top 0.254: IC1.6 U2.2
N$3
  Top 0.254: IC1.3 U2.5
N$4
  Top 0.254: IC1.5 U2.3
N$5
  Top 0.254: IC1.4 U2.4
N$6
  Top 0.254: IC1.2 U2.6
N$7
  Top 0.254: IC1.1 U2.7
N$8  (via drill 0.5)
  Top 0.508: U2.8 v180.34,38.1 | IC1.15 v175.26,38.1
  Bottom 0.508: v175.26,38.1 v180.34,38.1
N$9  (via drill 0.35)
  Top 0.406: U1.9 v53.34,26.67 | v34.29,26.67 v34.29,5.08 | v105.41,5.08 105.41,25.4 Y1.1
  Bottom 0.406: v53.34,26.67 v34.29,26.67 | v34.29,5.08 v105.41,5.08
N$10  (via drill 0.35)
  Top 0.406: U1.10 v50.8,27.94 | v35.56,27.94 v35.56,3.81 | Y1.3 v102.87,3.81
  Bottom 0.406: v50.8,27.94 v35.56,27.94 | v35.56,3.81 v102.87,3.81
N$11
  Top 0.254: IC2.7 U3.1
N$12
  Top 0.254: IC2.6 U3.2
N$13
  Top 0.254: IC2.5 U3.3
N$14
  Top 0.254: IC2.4 U3.4
N$15
  Top 0.254: IC2.3 U3.5
N$16
  Top 0.254: IC2.2 U3.6
N$17
  Top 0.254: IC2.1 U3.7
N$18  (via drill 0.35)
  Top 0.406: IC2.15 v144.78,34.29 | v149.86,34.29 U3.8
  Bottom 0.406: v149.86,34.29 v144.78,34.29
N$19
  Top 0.254: U4.1 IC3.7
N$20
  Top 0.254: U4.2 IC3.6
N$21
  Top 0.254: U4.3 IC3.5
N$22
  Top 0.254: U4.4 IC3.4
N$23
  Top 0.254: U4.5 IC3.3
N$24
  Top 0.254: U4.6 IC3.2
N$25
  Top 0.254: U4.7 IC3.1
N$26  (via drill 0.35)
  Top 0.406: IC3.15 v113.03,34.29 | v118.11,34.29 U4.8
  Bottom 0.406: v113.03,34.29 v118.11,34.29
N$27
  Top 0.254: U5.1 IC4.7
N$28
  Top 0.254: U5.2 IC4.6
N$29
  Top 0.254: U5.3 IC4.5
N$30
  Top 0.254: U5.4 IC4.4
N$31
  Top 0.254: U5.5 IC4.3
N$32
  Top 0.254: U5.6 IC4.2
N$33
  Top 0.254: U5.7 IC4.1
N$34  (via drill 0.35)
  Top 0.508: IC4.15 v83.82,31.75 | v88.9,31.75 U5.8
  Bottom 0.406: v83.82,31.75 v88.9,31.75
N$35
  Top 0.254: IC5.7 U6.1
N$36
  Top 0.254: IC5.6 U6.2
N$37
  Top 0.254: IC5.5 U6.3
N$38
  Top 0.254: IC5.4 U6.4
N$39
  Top 0.254: IC5.3 U6.5
N$40
  Top 0.254: IC5.2 U6.6
N$41
  Top 0.254: IC5.1 U6.7
N$42
  Top 0.508: IC5.15 53.34,31.75 58.42,31.75 U6.8
N$43
  Top 0.254: IC6.7 U7.1
N$44
  Top 0.254: IC6.6 U7.2
N$45
  Top 0.254: IC6.5 U7.3
N$46
  Top 0.254: IC6.4 U7.4
N$47
  Top 0.254: IC6.3 U7.5
N$48
  Top 0.254: IC6.2 U7.6
N$49
  Top 0.254: IC6.1 U7.7
N$50  (via drill 0.35)
  Top 0.508: IC6.15 v22.86,30.48 | v27.94,30.48 U7.8
  Bottom 0.508: v22.86,30.48 v27.94,30.48
N$51
  Top 0.406: D1.K 15.24,30.48 15.24,11.43 R2.P$1
RESET  (via drill 0.35)
  Top 0.406: U1.1 v73.66,26.67 | v91.44,26.67 R1.P$1
  Bottom 0.406: v73.66,26.67 v91.44,26.67 | C2.2 73.53,21.46 73.66,21.59 U1.1
  Bottom 0.508: C2.2 10.29,21.46 J2.5
RX  (via drill 0.35)
  Top 0.406: J3.3 88.9,15.24 87.63,15.24 87.63,24.13 85.09,24.13 v85.09,27.94 | U1.2 v71.12,27.94
  Bottom 0.406: v85.09,27.94 v71.12,27.94
SCK  (via drill 0.35)
  Top 0.508: U1.19 v50.8,11.43 | v22.86,11.43 v22.86,19.05
  Bottom 0.406: v22.86,11.43 v50.8,11.43
  Bottom 0.508: v22.86,19.05 J2.3
SCL  (via drill 0.35)
  Top 0.406: v113.03,7.62 DS3231_BREAKOUT_HEADER.3
  Top 0.508: U1.28 v73.66,7.62
  Bottom 0.406: v73.66,7.62 v113.03,7.62
SDA  (via drill 0.35)
  Top 0.406: v115.57,6.35 DS3231_BREAKOUT_HEADER.4
  Top 0.508: U1.27 v71.12,6.35
  Bottom 0.406: v71.12,6.35 v115.57,6.35
SER1  (via drill 0.35)
  Top 0.406: U1.4 v66.04,45.72
  Bottom 0.406: v66.04,45.72 172.72,45.72 IC1.14
SER2  (via drill 0.35)
  Top 0.406: U1.5 63.5,26.67 64.77,26.67 v64.77,29.21 | v134.62,29.21 v134.62,34.29 | v142.24,34.29 IC2.14
  Bottom 0.406: v64.77,29.21 v134.62,29.21 | v134.62,34.29 v142.24,34.29
SER3  (via drill 0.35)
  Top 0.406: U1.6 60.96,27.94 63.5,27.94 v63.5,31.75 | v110.49,34.29 IC3.14 | v82.55,31.75 v82.55,34.29
  Bottom 0.406: v63.5,31.75 v82.55,31.75 | v110.49,34.29 v85.09,34.29 v82.55,34.29
SER4  (via drill 0.35)
  Top 0.406: U1.11 v48.26,29.21 | v36.83,29.21 v36.83,2.54 | v81.28,2.54 IC4.14
  Bottom 0.406: v48.26,29.21 v36.83,29.21 | v36.83,2.54 v81.28,2.54
SER5  (via drill 0.35)
  Top 0.406: v50.8,34.29 IC5.14 | U1.12 v45.72,34.29
  Bottom 0.406: v45.72,34.29 v50.8,34.29
SER6  (via drill 0.35)
  Top 0.406: v43.18,34.29 U1.13
  Top 0.508: IC6.14 v20.32,34.29
  Bottom 0.406: v20.32,34.29 v43.18,34.29
SR_CLK  (via drill 0.35, 0.5)
  Top 0.406: U1.23 v60.96,10.16 | v80.01,11.43 v80.01,38.1 | v134.62,38.1 IC2.11 | v102.87,38.1 IC3.11 | v165.1,38.1 IC1.11
  Top 0.508: IC5.11 v43.18,38.1 | IC6.11 v12.7,38.1 | IC4.11 v73.66,38.1
  Bottom 0.406: v80.01,11.43 78.74,10.16 v60.96,10.16 | v73.66,38.1 v80.01,38.1 v102.87,38.1 v134.62,38.1 v165.1,38.1
  Bottom 0.508: v12.7,38.1 v43.18,38.1 v73.66,38.1
SR_RCK  (via drill 0.35, 0.5)
  Top 0.406: U1.25 v66.04,12.7 | v76.2,12.7 v76.2,39.37 | v167.64,39.37 IC1.12 | v137.16,39.37 IC2.12 | v105.41,39.37 IC3.12
  Top 0.508: IC5.12 v45.72,39.37 | IC6.12 v15.24,39.37 | IC4.12 v76.2,39.37
  Bottom 0.406: v76.2,12.7 v66.04,12.7 | v76.2,39.37 v105.41,39.37 v137.16,39.37 v167.64,39.37
  Bottom 0.508: v15.24,39.37 v45.72,39.37 v76.2,39.37
SR_SCL  (via drill 0.35, 0.5)
  Top 0.406: U1.24 v63.5,11.43 | v77.47,11.43 v77.47,36.83 | v162.56,36.83 IC1.10 | v100.33,36.83 IC3.10 | IC2.10 v132.08,36.83
  Top 0.508: IC6.10 v10.16,36.83 | IC5.10 v40.64,36.83 | IC4.10 v71.12,36.83
  Bottom 0.406: v77.47,11.43 v63.5,11.43 | v71.12,36.83 v77.47,36.83 v100.33,36.83 v132.08,36.83 v162.56,36.83
  Bottom 0.508: v10.16,36.83 v40.64,36.83 v71.12,36.83
TX  (via drill 0.35)
  Top 0.406: v78.74,20.32 v78.74,34.29 | v68.58,34.29 U1.3
  Bottom 0.406: J3.2 86.36,20.32 v78.74,20.32 | v78.74,34.29 v68.58,34.29
VFD1A  (via drill 0.5)
  Top 0.508: v156.21,67.31 156.21,60.96 U2.18 | N1.6 168.91,76.68 v168.91,67.31
  Bottom 0.508: v156.21,67.31 v168.91,67.31
VFD1B
  Top 0.508: U2.17 165.1,77.23 N1.5
VFD1C  (via drill 0.5)
  Top 0.508: U2.16 v167.64,69.85 | v161.29,69.85 161.29,81.28 164.35,81.28 N1.3
  Bottom 0.508: v167.64,69.85 v161.29,69.85
VFD1D  (via drill 0.5)
  Top 0.508: U2.15 v170.18,64.77 | N1.0 182.88,82.94 v182.88,64.77
  Bottom 0.508: v170.18,64.77 v182.88,64.77
VFD1DP  (via drill 0.5)
  Top 0.508: U2.11 v180.34,71.12 | N1.4 162.56,78.93 v162.56,71.12
  Bottom 0.508: v180.34,71.12 v162.56,71.12
VFD1E  (via drill 0.5)
  Top 0.508: U2.14 v172.72,72.39 | N1.9 173.37,81.28 177.8,81.28 v177.8,72.39
  Bottom 0.508: v172.72,72.39 v177.8,72.39
VFD1F
  Top 0.508: N1.8 175.26,78.45 U2.13
VFD1G  (via drill 0.5)
  Top 0.508: U2.12 v177.8,67.31 | N1.7 170.84,67.31 v171.45,67.31
  Bottom 0.508: v177.8,67.31 v171.45,67.31
VFD2A  (via drill 0.5)
  Top 0.508: U3.18 133.31,60.96 133.31,62.27 133.35,62.27 v133.35,72.39 | N2.6 146.05,76.68 v146.05,72.39
  Bottom 0.508: v133.35,72.39 v146.05,72.39
VFD2B  (via drill 0.5)
  Top 0.508: U3.17 v134.62,71.12 | N2.5 142.24,77.23 v142.24,71.12
  Bottom 0.508: v142.24,71.12 v134.62,71.12
VFD2C
  Top 0.508: N2.3 137.16,81.09 U3.16
VFD2D  (via drill 0.5)
  Top 0.508: U3.15 v139.7,64.77 | v152.4,64.77 152.4,82.94 N2.0
  Bottom 0.508: v139.7,64.77 v152.4,64.77
VFD2DP  (via drill 0.5)
  Top 0.508: U3.11 v149.86,66.04 | N2.4 142.21,78.74 138.43,78.74 v138.43,66.04
  Bottom 0.508: v138.43,66.04 v149.86,66.04
VFD2E  (via drill 0.5)
  Top 0.508: U3.14 v142.24,67.31 | v151.13,67.31 151.13,80.7 N2.9
  Bottom 0.508: v142.24,67.31 v151.13,67.31
VFD2F  (via drill 0.5)
  Top 0.508: N2.8 149.86,78.45 v149.86,69.85 | U3.13 v144.78,69.85
  Bottom 0.508: v144.78,69.85 v149.86,69.85
VFD2G
  Top 0.508: N2.7 147.98,73.66 147.32,73.66 U3.12
VFD3A  (via drill 0.5)
  Top 0.508: N3.6 106.68,76.68 v106.68,71.12 | v100.33,71.12 U4.18
  Bottom 0.508: v106.68,71.12 v100.33,71.12
VFD3B
  Top 0.508: N3.5 102.87,77.23 U4.17
VFD3C  (via drill 0.5)
  Top 0.508: N3.3 97.79,81.09 v97.79,67.31 | U4.16 v105.41,67.31
  Bottom 0.508: v97.79,67.31 v105.41,67.31
VFD3D  (via drill 0.5)
  Top 0.508: U4.15 v107.95,68.58 | v123.19,68.58 123.19,82.55 110.92,82.55 N3.0
  Bottom 0.508: v107.95,68.58 v123.19,68.58
VFD3DP  (via drill 0.5)
  Top 0.508: U4.11 v118.11,73.66 | N3.4 100.33,78.93 v100.33,73.66
  Bottom 0.508: v100.33,73.66 v118.11,73.66
VFD3E  (via drill 0.5)
  Top 0.508: U4.14 v110.49,69.85 | N3.9 121.92,80.7 v121.92,69.85
  Bottom 0.508: v110.49,69.85 v121.92,69.85
VFD3F  (via drill 0.5)
  Top 0.508: U4.13 v113.03,71.12 | N3.8 120.65,78.45 v120.65,71.12
  Bottom 0.508: v113.03,71.12 v120.65,71.12
VFD3G  (via drill 0.5)
  Top 0.508: U4.12 v115.57,72.39 | v119.38,72.39 119.38,74.93 108.61,74.93 N3.7
  Bottom 0.508: v115.57,72.39 v119.38,72.39
VFD4A  (via drill 0.5)
  Top 0.508: N4.6 85.06,71.12 v85.09,71.12 | U5.18 71.08,61 71.08,63.54 71.12,63.54 v71.12,71.12
  Bottom 0.508: v71.12,71.12 v85.09,71.12
VFD4B  (via drill 0.5)
  Top 0.508: N4.5 81.28,77.23 v81.28,72.39 | U5.17 v73.66,72.39
  Bottom 0.508: v81.28,72.39 v73.66,72.39
VFD4C
  Top 0.508: N4.3 76.2,81.09 U5.16
VFD4D  (via drill 0.5)
  Top 0.508: U5.15 v78.74,66.04 | N4.0 93.98,82.94 v93.98,66.04
  Bottom 0.508: v93.98,66.04 v78.74,66.04
VFD4DP  (via drill 0.5)
  Top 0.508: U5.11 v88.9,67.31 | N4.4 78.74,78.93 v78.74,67.31
  Bottom 0.508: v78.74,67.31 v88.9,67.31
VFD4E  (via drill 0.5)
  Top 0.508: N4.9 91.44,80.7 v91.44,68.58 | U5.14 v81.28,68.58
  Bottom 0.508: v91.44,68.58 v81.28,68.58
VFD4F  (via drill 0.5)
  Top 0.508: N4.8 88.9,78.45 v88.9,69.85 | U5.13 v83.82,69.85
  Bottom 0.508: v83.82,69.85 v88.9,69.85
VFD4G
  Top 0.508: N4.7 87.02,72.39 86.36,72.39 U5.12
VFD5A  (via drill 0.5)
  Top 0.508: N5.6 v45.72,71.12 | U6.18 v40.64,71.12
  Bottom 0.508: v40.64,71.12 v45.72,71.12
VFD5B
  Top 0.508: N5.5 43.18,77.23 U6.17
VFD5C  (via drill 0.5)
  Top 0.508: N5.3 39.37,81.09 v39.37,68.58 | U6.16 v45.72,68.58
  Bottom 0.508: v39.37,68.58 v45.72,68.58
VFD5D  (via drill 0.5)
  Top 0.508: N5.0 55.88,82.94 v55.88,67.31 | v48.26,67.31 U6.15
  Bottom 0.508: v55.88,67.31 v48.26,67.31
VFD5DP  (via drill 0.5)
  Top 0.508: N5.4 41.88,72.39 v41.91,72.39 | U6.11 v58.42,72.39
  Bottom 0.508: v41.91,72.39 v58.42,72.39
VFD5E  (via drill 0.5)
  Top 0.508: N5.9 54.61,80.7 v54.61,68.58 | v50.8,68.58 U6.14
  Bottom 0.508: v54.61,68.58 v50.8,68.58
VFD5F
  Top 0.508: N5.8 53.34,78.45 U6.13
VFD5G  (via drill 0.5)
  Top 0.508: U6.12 v55.88,66.04 | N5.7 47.65,74.93 46.99,74.93 v46.99,66.04
  Bottom 0.508: v55.88,66.04 v46.99,66.04
VFD6A  (via drill 0.5)
  Top 0.508: N6.6 22.83,74.93 v15.24,74.93 | v10.16,74.93 U7.18
  Bottom 0.508: v15.24,74.93 v10.16,74.93
VFD6B  (via drill 0.5)
  Top 0.508: v12.7,76.2 U7.17
  Bottom 0.508: N6.5 12.7,77.23 v12.7,76.2
VFD6C  (via drill 0.5)
  Top 0.508: N6.3 11.43,81.09 v11.43,67.31 | v15.24,67.31 U7.16
  Bottom 0.508: v15.24,67.31 v11.43,67.31
VFD6D  (via drill 0.5)
  Top 0.508: N6.0 27.1,82.55 30.48,82.55 v30.48,69.85 | v17.78,69.85 U7.15
  Bottom 0.508: v30.48,69.85 v17.78,69.85
VFD6DP  (via drill 0.5)
  Top 0.508: N6.4 19.02,78.74 13.97,78.74 v13.97,68.58 | v27.94,68.58 U7.11
  Bottom 0.508: v27.94,68.58 v13.97,68.58
VFD6E  (via drill 0.5)
  Top 0.508: N6.9 29.21,80.7 v29.21,71.12 | v20.32,71.12 U7.14
  Bottom 0.508: v29.21,71.12 v20.32,71.12
VFD6F  (via drill 0.5)
  Top 0.508: N6.8 27.94,78.45 v27.94,72.39 | v22.86,72.39 U7.13
  Bottom 0.508: v27.94,72.39 v22.86,72.39
VFD6G
  Top 0.508: N6.7 25.15,77.09 25.15,77.08 25.4,77.08 U7.12

### Text on the board
tPlace: VFD Clock | Designed By / Adrian Del Grosso